# EAGLE design csa_ramdisk-v1.0c (EAGLE 4.16)
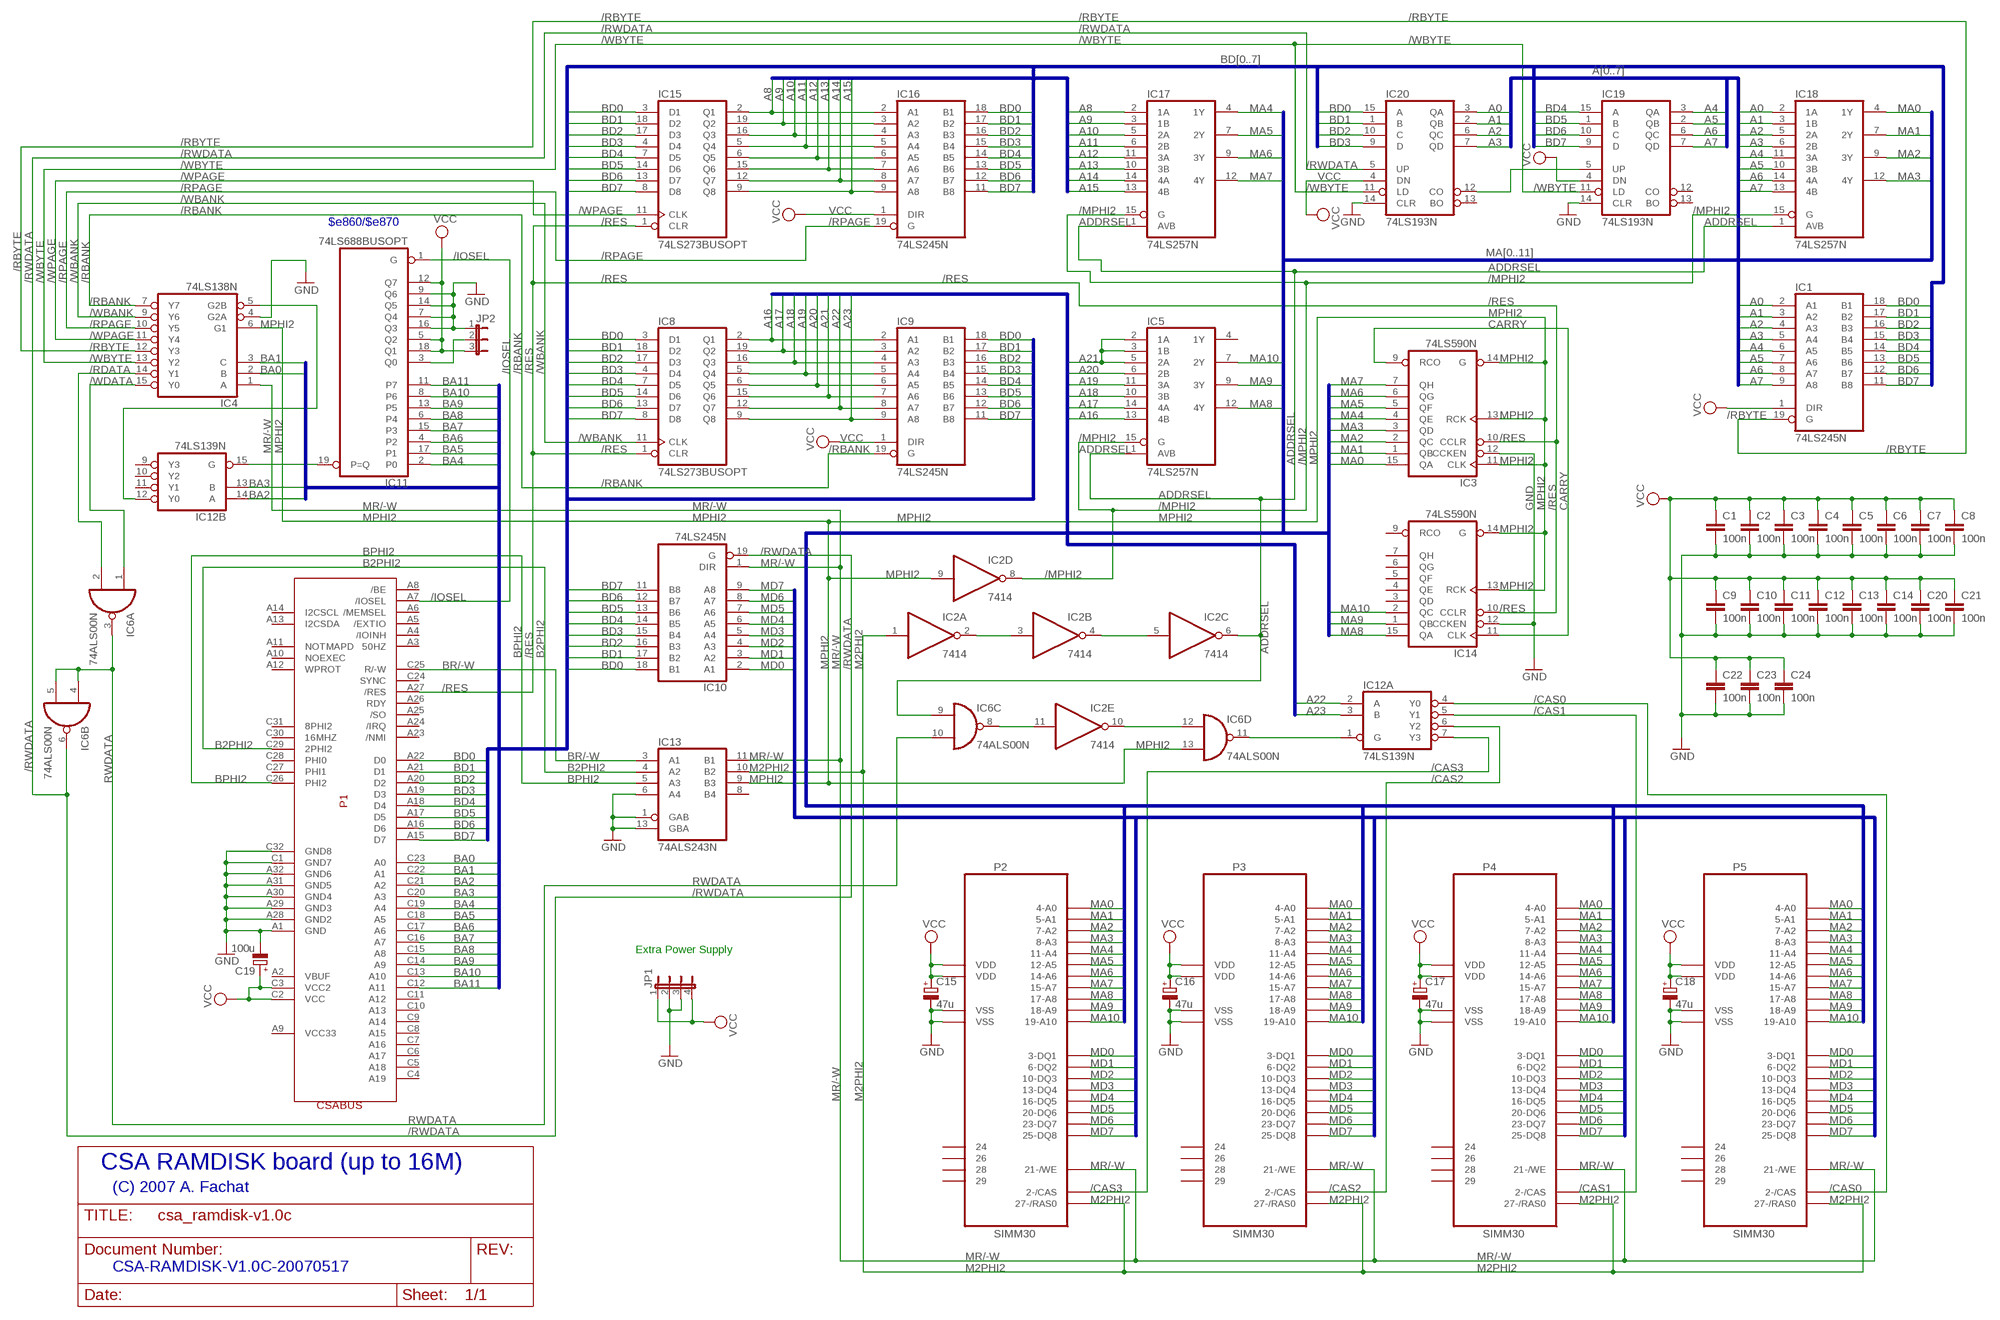
[diagram p0: schematic, sheet 1]

## Parts
C1  100n  C-EU050-025X075  [C050-025X075]
C2  100n  C-EU050-025X075  [C050-025X075]
C3  100n  C-EU050-025X075  [C050-025X075]
C4  100n  C-EU050-025X075  [C050-025X075]
C5  100n  C-EU050-025X075  [C050-025X075]
C6  100n  C-EU050-025X075  [C050-025X075]
C7  100n  C-EU050-025X075  [C050-025X075]
C8  100n  C-EU050-025X075  [C050-025X075]
C9  100n  C-EU050-025X075  [C050-025X075]
C10  100n  C-EU050-025X075  [C050-025X075]
C11  100n  C-EU050-025X075  [C050-025X075]
C12  100n  C-EU050-025X075  [C050-025X075]
C13  100n  C-EU050-025X075  [C050-025X075]
C14  100n  C-EU050-025X075  [C050-025X075]
C15  47u  CPOL-EUE2-5  [E2-5]
C16  47u  CPOL-EUE2-5  [E2-5]
C17  47u  CPOL-EUE2-5  [E2-5]
C18  47u  CPOL-EUE2-5  [E2-5]
C19  100u  CPOL-EUE2-5  [E2-5]
C20  100n  C-EU050-025X075  [C050-025X075]
C21  100n  C-EU050-025X075  [C050-025X075]
C22  100n  C-EU050-025X075  [C050-025X075]
C23  100n  C-EU050-025X075  [C050-025X075]
C24  100n  C-EU050-025X075  [C050-025X075]
IC1  74LS245N  [DIL20]
IC2  7414  74LS04N  [DIL14]
IC3  74LS590N  [DIL16]
IC4  74LS138N  [DIL16]
IC5  74LS257N  [DIL16]
IC6  74ALS00N  [DIL14]
IC8  74LS273BUSOPT  [DIL20]
IC9  74LS245N  [DIL20]
IC10  74LS245N  [DIL20]
IC11  74LS688BUSOPT  [DIL20]
IC12  74LS139N  [DIL16]
IC13  74ALS243N  74LS243N  [DIL14]
IC14  74LS590N  [DIL16]
IC15  74LS273BUSOPT  [DIL20]
IC16  74LS245N  [DIL20]
IC17  74LS257N  [DIL16]
IC18  74LS257N  [DIL16]
IC19  74LS193N  74LS192N  [DIL16]
IC20  74LS193N  74LS192N  [DIL16]
JP1  JP4E  [JP4]
JP2  JP2E  [JP2]
P1  CSABUS  [CSABUS]
P2  SIMM30  [SIMM30]
P3  SIMM30  [SIMM30]
P4  SIMM30  [SIMM30]
P5  SIMM30  [SIMM30]

## Nets
/CAS0: IC12.4(A:Y0) P5.2(2-/CAS)
/CAS1: IC12.5(A:Y1) P4.2(2-/CAS)
/CAS2: IC12.6(A:Y2) P3.2(2-/CAS)
/CAS3: IC12.7(A:Y3) P2.2(2-/CAS)
/IOSEL: IC11.1(G) P1.A7(/IOSEL)
/MPHI2: IC2.8(D:O) IC5.15(G) IC17.15(G) IC18.15(G)
/RBANK: IC4.7(Y7) IC9.19(G)
/RBYTE: IC1.19(G) IC4.12(Y3)
/RDATA: IC4.14(Y1) IC6.2(A:I1)
/RES: IC3.10(CCLR) IC8.1(CLR) IC14.10(CCLR) IC15.1(CLR) P1.A27(/RES)
/RPAGE: IC4.10(Y5) IC16.19(G)
/RWDATA: IC6.6(B:O) IC10.19(G) IC20.5(UP)
/WBANK: IC4.9(Y6) IC8.11(CLK)
/WBYTE: IC4.13(Y2) IC19.11(LD) IC20.11(LD)
/WDATA: IC4.15(Y0) IC6.1(A:I0)
/WPAGE: IC4.11(Y4) IC15.11(CLK)
A0: IC1.2(A1) IC18.2(1A) IC20.3(QA)
A1: IC1.3(A2) IC18.3(1B) IC20.2(QB)
A2: IC1.4(A3) IC18.5(2A) IC20.6(QC)
A3: IC1.5(A4) IC18.6(2B) IC20.7(QD)
A4: IC1.6(A5) IC18.11(3A) IC19.3(QA)
A5: IC1.7(A6) IC18.10(3B) IC19.2(QB)
A6: IC1.8(A7) IC18.14(4A) IC19.6(QC)
A7: IC1.9(A8) IC18.13(4B) IC19.7(QD)
A8: IC15.2(Q1) IC16.2(A1) IC17.2(1A)
A9: IC15.19(Q2) IC16.3(A2) IC17.3(1B)
A10: IC15.16(Q3) IC16.4(A3) IC17.5(2A)
A11: IC15.5(Q4) IC16.5(A4) IC17.6(2B)
A12: IC15.6(Q5) IC16.6(A5) IC17.11(3A)
A13: IC15.15(Q6) IC16.7(A6) IC17.10(3B)
A14: IC15.12(Q7) IC16.8(A7) IC17.14(4A)
A15: IC15.9(Q8) IC16.9(A8) IC17.13(4B)
A16: IC5.13(4B) IC8.2(Q1) IC9.2(A1)
A17: IC5.14(4A) IC8.19(Q2) IC9.3(A2)
A18: IC5.10(3B) IC8.16(Q3) IC9.4(A3)
A19: IC5.11(3A) IC8.5(Q4) IC9.5(A4)
A20: IC5.6(2B) IC8.6(Q5) IC9.6(A5)
A21: IC5.2(1A) IC5.3(1B) IC5.5(2A) IC8.15(Q6) IC9.7(A6)
A22: IC8.12(Q7) IC9.8(A7) IC12.2(A:A)
A23: IC8.9(Q8) IC9.9(A8) IC12.3(A:B)
ADDRSEL: IC2.6(C:O) IC5.1(A\/B) IC6.9(C:I0) IC17.1(A\/B) IC18.1(A\/B)
B2PHI2: IC13.4(A2) P1.C29(2PHI2)
BA0: IC4.2(B) P1.C23(A0)
BA1: IC4.3(C) P1.C22(A1)
BA2: IC12.14(B:A) P1.C21(A2)
BA3: IC12.13(B:B) P1.C20(A3)
BA4: IC11.2(P0) P1.C19(A4)
BA5: IC11.17(P1) P1.C18(A5)
BA6: IC11.4(P2) P1.C17(A6)
BA7: IC11.15(P3) P1.C16(A7)
BA8: IC11.6(P4) P1.C15(A8)
BA9: IC11.13(P5) P1.C14(A9)
BA10: IC11.8(P6) P1.C13(A10)
BA11: IC11.11(P7) P1.C12(A11)
BD0: IC1.18(B1) IC8.3(D1) IC9.18(B1) IC10.18(B1) IC15.3(D1) IC16.18(B1) IC20.15(A) P1.A22(D0)
BD1: IC1.17(B2) IC8.18(D2) IC9.17(B2) IC10.17(B2) IC15.18(D2) IC16.17(B2) IC20.1(B) P1.A21(D1)
BD2: IC1.16(B3) IC8.17(D3) IC9.16(B3) IC10.16(B3) IC15.17(D3) IC16.16(B3) IC20.10(C) P1.A20(D2)
BD3: IC1.15(B4) IC8.4(D4) IC9.15(B4) IC10.15(B4) IC15.4(D4) IC16.15(B4) IC20.9(D) P1.A19(D3)
BD4: IC1.14(B5) IC8.7(D5) IC9.14(B5) IC10.14(B5) IC15.7(D5) IC16.14(B5) IC19.15(A) P1.A18(D4)
BD5: IC1.13(B6) IC8.14(D6) IC9.13(B6) IC10.13(B6) IC15.14(D6) IC16.13(B6) IC19.1(B) P1.A17(D5)
BD6: IC1.12(B7) IC8.13(D7) IC9.12(B7) IC10.12(B7) IC15.13(D7) IC16.12(B7) IC19.10(C) P1.A16(D6)
BD7: IC1.11(B8) IC8.8(D8) IC9.11(B8) IC10.11(B8) IC15.8(D8) IC16.11(B8) IC19.9(D) P1.A15(D7)
BPHI2: IC13.5(A3) P1.C26(PHI2)
BR/-W: IC13.3(A1) P1.C25(R/-W)
CARRY: IC3.9(RCO) IC14.11(CLK)
GND: C1.2 C2.2 C3.2 C4.2 C5.2 C6.2 C7.2 C8.2 C9.2 C10.2 C11.2 C12.2 C13.2 C14.2 C15.- C16.- C17.- C18.- C19.- C20.2 C21.2 C22.2 C23.2 C24.2 IC3.12(CCKEN) IC4.4(G2A) IC11.7(Q4) IC11.9(Q6) IC11.14(Q5) IC11.16(Q3) IC13.1(GAB) IC13.6(A4) IC13.13(GBA) IC14.12(CCKEN) IC19.14(CLR) IC20.14(CLR) JP1.2 JP1.3 JP2.1 P1.A1(GND) P1.A28(GND2) P1.A29(GND3) P1.A30(GND4) P1.A31(GND5) P1.A32(GND6) P1.C1(GND7) P1.C32(GND8) P2.9(VSS) P2.22(VSS) P3.9(VSS) P3.22(VSS) P4.9(VSS) P4.22(VSS) P5.9(VSS) P5.22(VSS)
M2PHI2: IC2.1(A:I) IC13.10(B2) P2.27(27-/RAS0) P3.27(27-/RAS0) P4.27(27-/RAS0) P5.27(27-/RAS0)
MA0: IC3.15(QA) IC18.4(1Y) P2.4(4-A0) P3.4(4-A0) P4.4(4-A0) P5.4(4-A0)
MA1: IC3.1(QB) IC18.7(2Y) P2.5(5-A1) P3.5(5-A1) P4.5(5-A1) P5.5(5-A1)
MA2: IC3.2(QC) IC18.9(3Y) P2.7(7-A2) P3.7(7-A2) P4.7(7-A2) P5.7(7-A2)
MA3: IC3.3(QD) IC18.12(4Y) P2.8(8-A3) P3.8(8-A3) P4.8(8-A3) P5.8(8-A3)
MA4: IC3.4(QE) IC17.4(1Y) P2.11(11-A4) P3.11(11-A4) P4.11(11-A4) P5.11(11-A4)
MA5: IC3.5(QF) IC17.7(2Y) P2.12(12-A5) P3.12(12-A5) P4.12(12-A5) P5.12(12-A5)
MA6: IC3.6(QG) IC17.9(3Y) P2.14(14-A6) P3.14(14-A6) P4.14(14-A6) P5.14(14-A6)
MA7: IC3.7(QH) IC17.12(4Y) P2.15(15-A7) P3.15(15-A7) P4.15(15-A7) P5.15(15-A7)
MA8: IC5.12(4Y) IC14.15(QA) P2.17(17-A8) P3.17(17-A8) P4.17(17-A8) P5.17(17-A8)
MA9: IC5.9(3Y) IC14.1(QB) P2.18(18-A9) P3.18(18-A9) P4.18(18-A9) P5.18(18-A9)
MA10: IC5.7(2Y) IC14.2(QC) P2.19(19-A10) P3.19(19-A10) P4.19(19-A10) P5.19(19-A10)
MD0: IC10.2(A1) P2.3(3-DQ1) P3.3(3-DQ1) P4.3(3-DQ1) P5.3(3-DQ1)
MD1: IC10.3(A2) P2.6(6-DQ2) P3.6(6-DQ2) P4.6(6-DQ2) P5.6(6-DQ2)
MD2: IC10.4(A3) P2.10(10-DQ3) P3.10(10-DQ3) P4.10(10-DQ3) P5.10(10-DQ3)
MD3: IC10.5(A4) P2.13(13-DQ4) P3.13(13-DQ4) P4.13(13-DQ4) P5.13(13-DQ4)
MD4: IC10.6(A5) P2.16(16-DQ5) P3.16(16-DQ5) P4.16(16-DQ5) P5.16(16-DQ5)
MD5: IC10.7(A6) P2.20(20-DQ6) P3.20(20-DQ6) P4.20(20-DQ6) P5.20(20-DQ6)
MD6: IC10.8(A7) P2.23(23-DQ7) P3.23(23-DQ7) P4.23(23-DQ7) P5.23(23-DQ7)
MD7: IC10.9(A8) P2.25(25-DQ8) P3.25(25-DQ8) P4.25(25-DQ8) P5.25(25-DQ8)
MPHI2: IC2.9(D:I) IC3.11(CLK) IC3.13(RCK) IC3.14(G) IC4.6(G1) IC6.13(D:I1) IC13.9(B3) IC14.13(RCK) IC14.14(G)
MR/-W: IC4.1(A) IC10.1(DIR) IC13.11(B1) P2.21(21-/WE) P3.21(21-/WE) P4.21(21-/WE) P5.21(21-/WE)
N$1: IC19.5(UP) IC20.12(CO)
N$2: IC2.11(E:I) IC6.8(C:O)
N$3: IC11.19(P=Q) IC12.15(B:G)
N$4: IC4.5(G2B) IC12.12(B:Y0)
N$5: IC11.3(Q0) JP2.2
N$6: IC6.11(D:O) IC12.1(A:G)
N$7: IC2.10(E:O) IC6.12(D:I0)
N$11: IC2.2(A:O) IC2.3(B:I)
N$12: IC2.4(B:O) IC2.5(C:I)
RWDATA: IC6.3(A:O) IC6.4(B:I0) IC6.5(B:I1) IC6.10(C:I1)
VCC: C1.1 C2.1 C3.1 C4.1 C5.1 C6.1 C7.1 C8.1 C9.1 C10.1 C11.1 C12.1 C13.1 C14.1 C15.+ C16.+ C17.+ C18.+ C19.+ C20.1 C21.1 C22.1 C23.1 C24.1 IC1.1(DIR) IC9.1(DIR) IC11.5(Q2) IC11.12(Q7) IC11.18(Q1) IC16.1(DIR) IC19.4(DN) IC20.4(DN) JP1.1 JP1.4 JP2.3 P1.C2(VCC) P1.C3(VCC2) P2.1(VDD) P2.30(VDD) P3.1(VDD) P3.30(VDD) P4.1(VDD) P4.30(VDD) P5.1(VDD) P5.30(VDD)
Unconnected: IC2.12(F:O) IC2.13(F:I) IC5.4(1Y) IC12.9(B:Y3) IC12.10(B:Y2) IC12.11(B:Y1) IC13.8(B4) IC14.3(QD) IC14.4(QE) IC14.5(QF) IC14.6(QG) IC14.7(QH) IC14.9(RCO) IC19.12(CO) IC19.13(BO) IC20.13(BO) P1.A2(VBUF) P1.A3(50HZ) P1.A4(/IOINH) P1.A5(/EXTIO) P1.A6(/MEMSEL) P1.A8(/BE) P1.A9(VCC33) P1.A10(NOEXEC) P1.A11(NOTMAPD) P1.A12(WPROT) P1.A13(I2CSDA) P1.A14(I2CSCL) P1.A23(/NMI) P1.A24(/IRQ) P1.A25(/SO) P1.A26(RDY) P1.C4(A19) P1.C5(A18) P1.C6(A17) P1.C7(A16) P1.C8(A15) P1.C9(A14) P1.C10(A13) P1.C11(A12) P1.C24(SYNC) P1.C27(PHI1) P1.C28(PHI0) P1.C30(16MHZ) P1.C31(8PHI2) P2.24 P2.26 P2.28 P2.29 P3.24 P3.26 P3.28 P3.29 P4.24 P4.26 P4.28 P4.29 P5.24 P5.26 P5.28 P5.29

## Buses
BA[0..19]
BD[0..7]
A[0..23]
MD[0..7]
MA[0..11]
A[8..15]
A[0..7]

## Notes on the sheet
- $e860/$e870
- Extra Power Supply
- CSA RAMDISK board (up to 16M)
- (C) 2007 A. Fachat
- CSA-RAMDISK-V1.0C-20070517

## Power pins joined to a net without a drawn wire
GND: IC1.10(GND) IC2.7(P:GND) IC3.8(GND) IC4.8(GND) IC5.8(GND) IC6.7(P:GND) IC8.10(GND) IC9.10(GND) IC10.10(GND) IC11.10(GND) IC12.8(P:GND) IC13.7(GND) IC14.8(GND) IC15.10(GND) IC16.10(GND) IC17.8(GND) IC18.8(GND) IC19.8(GND) IC20.8(GND)
VCC: IC1.20(VCC) IC2.14(P:VCC) IC3.16(VCC) IC4.16(VCC) IC5.16(VCC) IC6.14(P:VCC) IC8.20(VCC) IC9.20(VCC) IC10.20(VCC) IC11.20(VCC) IC12.16(P:VCC) IC13.14(VCC) IC14.16(VCC) IC15.20(VCC) IC16.20(VCC) IC17.16(VCC) IC18.16(VCC) IC19.16(VCC) IC20.16(VCC)

## Library data of the parts
C1-C14 C20-C24 = rcl:C-EU: CAPACITOR, European symbol
C15-C19 = rcl:CPOL-EU: POLARIZED CAPACITOR, European symbol
IC1 IC9 IC10 IC16 = 74xx-us:74*245: Octal BUS TRANSCEIVER, 3-state
IC2 = 74xx-us:74*04: Hex INVERTER
IC3 IC14 = 74xx-eu:74*590: 8-bit binary COUNTER, output register
IC4 = 74xx-eu:74*138: 3-line to 8-line DECODER/DEMULTIPLEXER
IC5 IC17 IC18 = 74xx-eu:74*257: Quadruple 2-to 1 line data SELECTOR/MULTIPLEXER
IC6 = 74xx-eu:74*00: Quad 2-input NAND gate
IC8 IC15 = csa:74LS273BUSOPT
IC11 = csa:74LS688BUSOPT
IC12 = 74xx-us:74*139: Dual 2-line to 4-line DECODER/DEMULTIPLEXER
IC13 = 74xx-us:74*243: Quadruple BUS TRANSCEIVER
IC19 IC20 = 74xx-eu:74*192: Synchronous 4-bit UP/DOWN COUNTER
JP1 = jumper:JP4E: JUMPER
JP2 = jumper:JP2E: JUMPER
P1 = csa:CSABUS
P2-P5 = csa:SIMM30

## Board
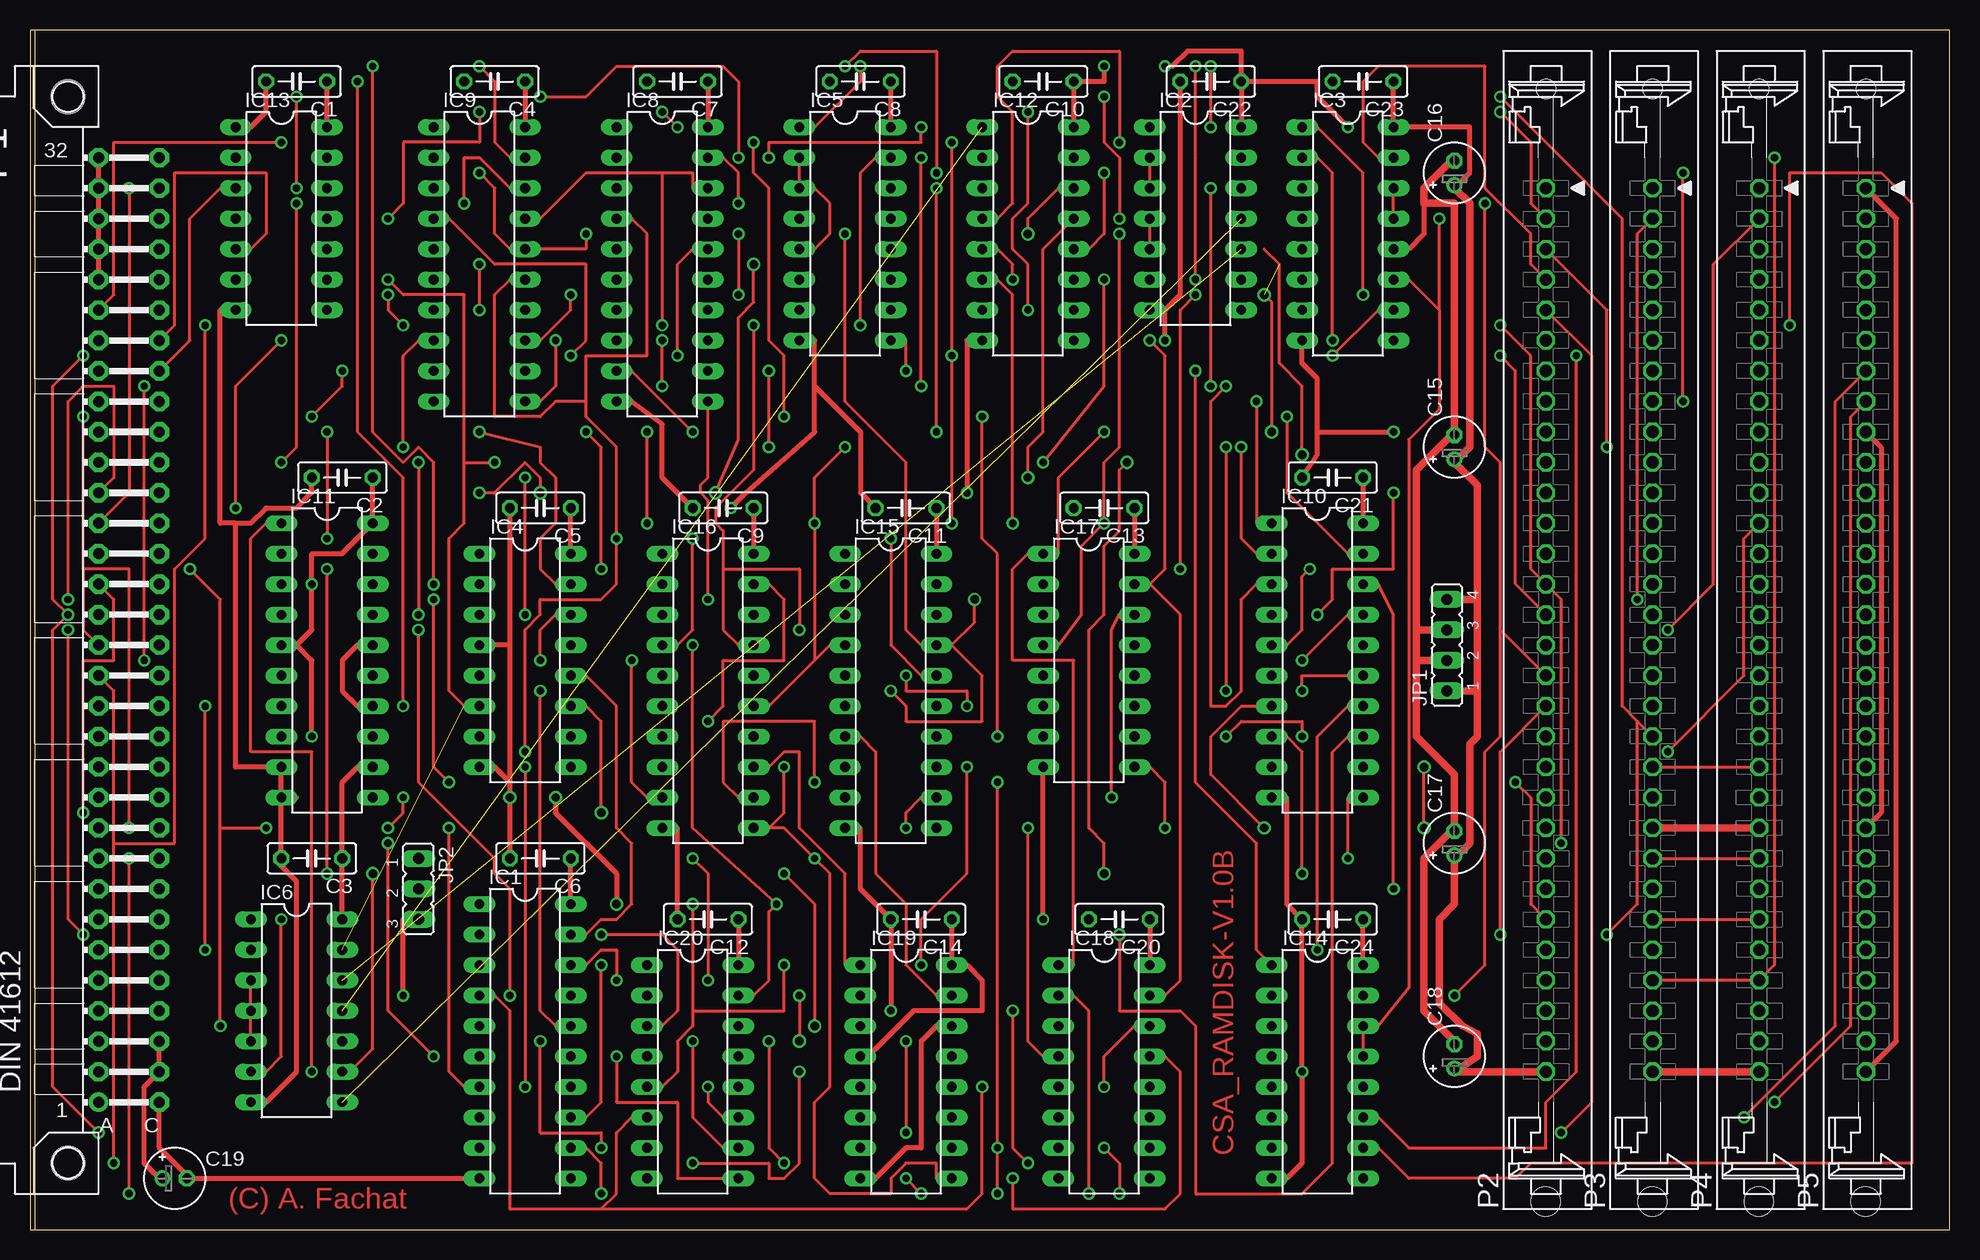
[diagram p1: board, top side]
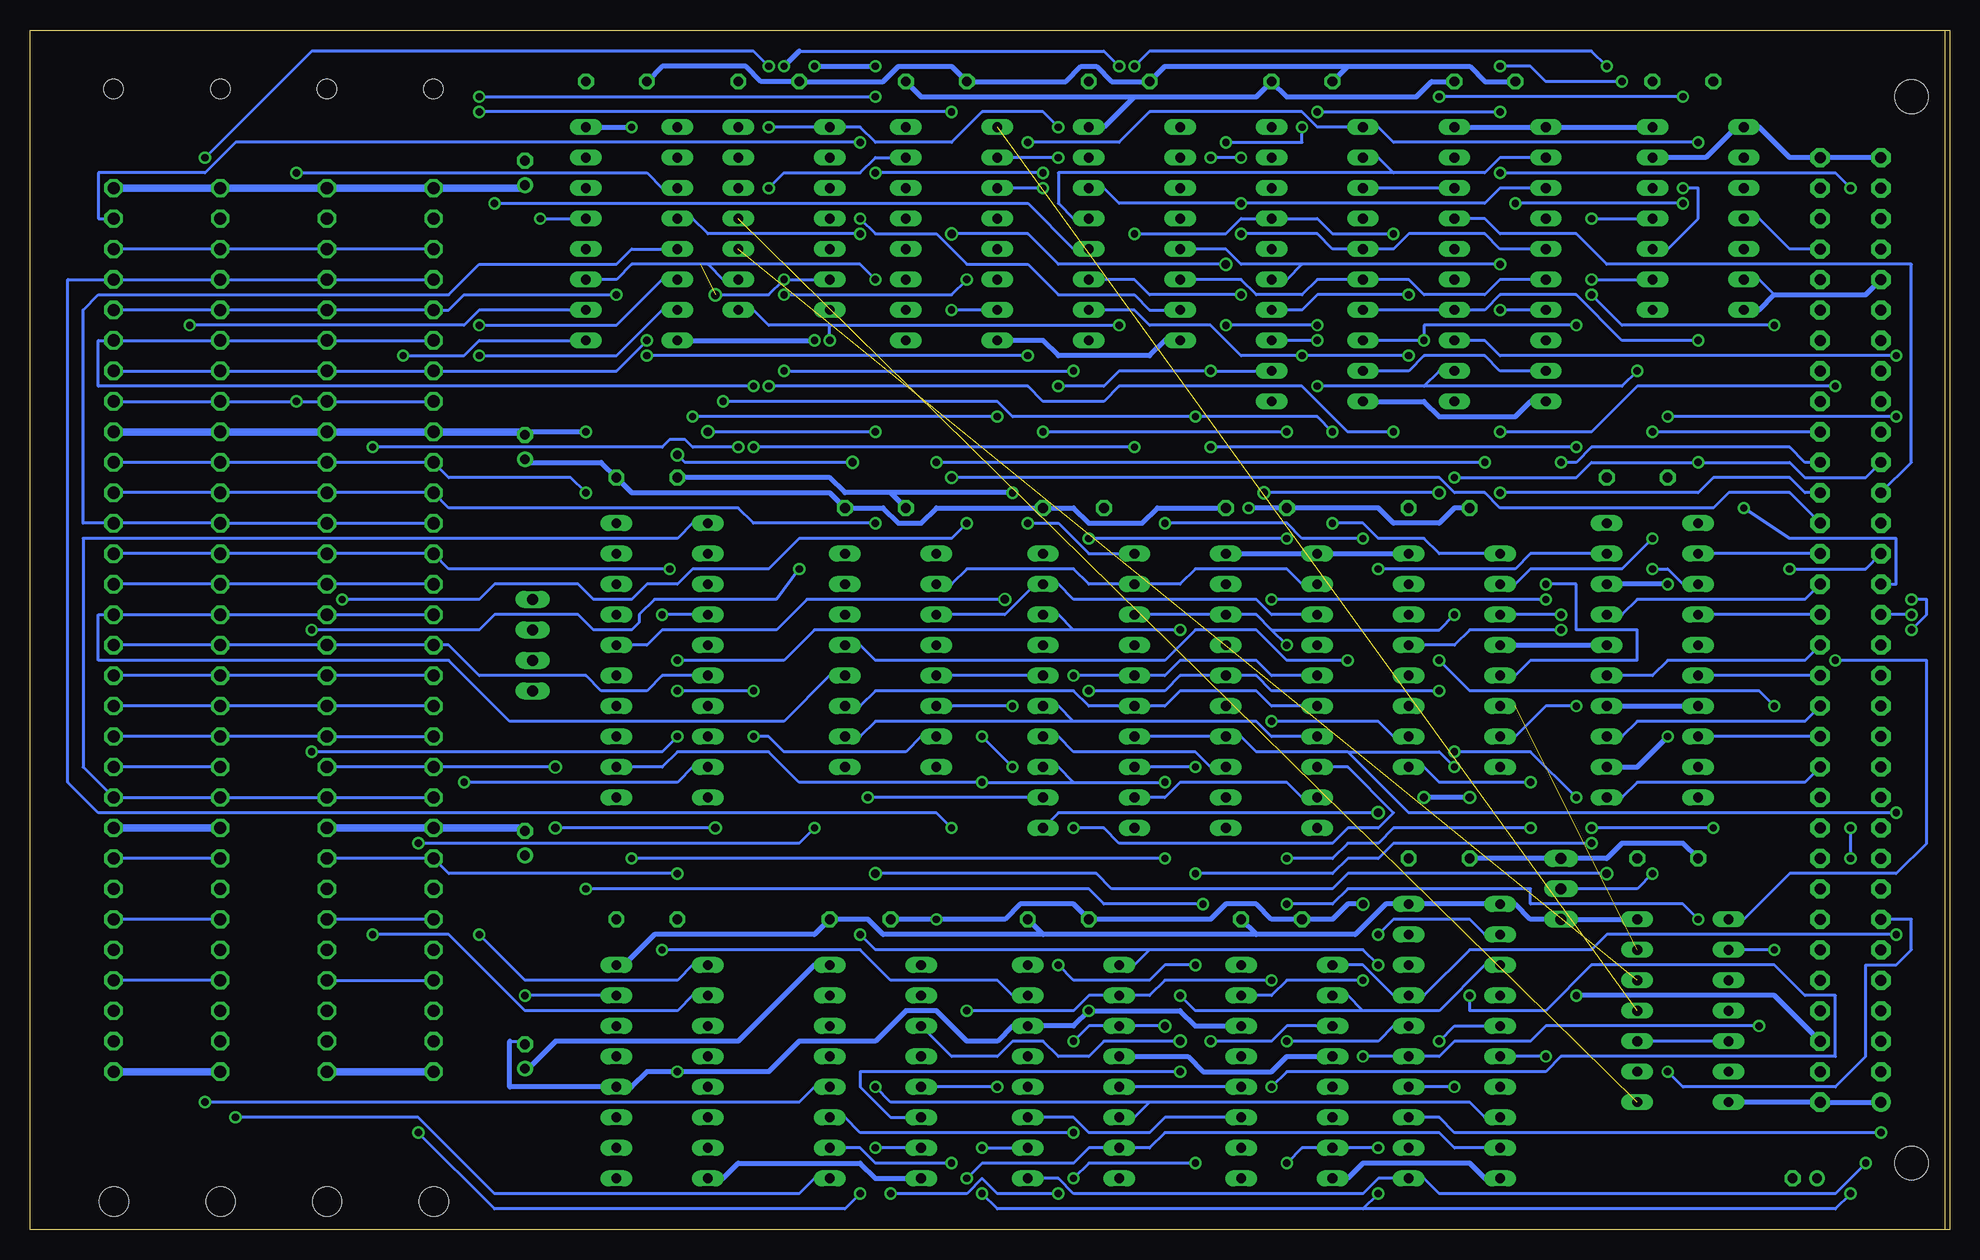
[diagram p2: board, bottom side, seen from below]

Size 160 x 100.03 mm. Coordinates in mm from the lower left corner, seen from the top.
Outline: 0,0.01 160,0.01 160,100.01 0,100.01 0,0.01
Copper layers (1*16): Top 0.035mm / dielectric 1.5mm / Bottom 0.035mm
Design rules "default": minimum track width 10mil, minimum drill 24mil, track to track 8mil, track to pad 8mil, pad to pad 8mil, via to via 8mil, smd to smd 8mil, copper to edge 40mil, drill to drill 8mil, minimum pad ring 10mil, minimum via ring 8mil, stop-mask expansion 4mil, vias tented up to drill 0mil, thermal gap 10mil

### Footprints (pad centres in the part's own frame; a part is rotated, then mirrored left to right if it is on the bottom)
C050-025X075 = drill 0.813 octagon: 1 -2.54,0; 2 2.54,0
E2-5 = drill 0.813 pad 1.27 round: + -1.016,0 | drill 0.813 pad 1.27 octagon: - 1.016,0
DIL20 = drill 0.813 long: 1 -11.43,-3.81; 2 -8.89,-3.81; 3 -6.35,-3.81; 4 -3.81,-3.81; 5 -1.27,-3.81; 6 1.27,-3.81; 7 3.81,-3.81; 8 6.35,-3.81; 9 8.89,-3.81; 10 11.43,-3.81; 11 11.43,3.81; 12 8.89,3.81; 13 6.35,3.81; 14 3.81,3.81; 15 1.27,3.81; 16 -1.27,3.81; 17 -3.81,3.81; 18 -6.35,3.81; 19 -8.89,3.81; 20 -11.43,3.81
DIL14 = drill 0.813 long: 1 -7.62,-3.81; 2 -5.08,-3.81; 3 -2.54,-3.81; 4 0,-3.81; 5 2.54,-3.81; 6 5.08,-3.81; 7 7.62,-3.81; 8 7.62,3.81; 9 5.08,3.81; 10 2.54,3.81; 11 0,3.81; 12 -2.54,3.81; 13 -5.08,3.81; 14 -7.62,3.81
DIL16 = drill 0.813 long: 1 -8.89,-3.81; 2 -6.35,-3.81; 3 -3.81,-3.81; 4 -1.27,-3.81; 5 1.27,-3.81; 6 3.81,-3.81; 7 6.35,-3.81; 8 8.89,-3.81; 9 8.89,3.81; 10 6.35,3.81; 11 3.81,3.81; 12 1.27,3.81; 13 -1.27,3.81; 14 -3.81,3.81; 15 -6.35,3.81; 16 -8.89,3.81
DIL20' = drill 0.813 long: 1 -10.16,-3.81; 2 -7.62,-3.81; 3 -5.08,-3.81; 4 -2.54,-3.81; 5 0,-3.81; 6 2.54,-3.81; 7 5.08,-3.81; 8 7.62,-3.81; 9 10.16,-3.81; 10 12.7,-3.81; 11 12.7,3.81; 12 10.16,3.81; 13 7.62,3.81; 14 5.08,3.81; 15 2.54,3.81; 16 0,3.81; 17 -2.54,3.81; 18 -5.08,3.81; 19 -7.62,3.81; 20 -10.16,3.81
JP4 = drill 0.914 long: 1 -3.81,0; 2 -1.27,0; 3 1.27,0; 4 3.81,0
JP2 = drill 0.914 long: 1 -2.54,0; 2 0,0; 3 2.54,0
CSABUS = drill 0.914 pad 1.6 round: A1 7.62,36.83 | drill 0.914 pad 1.6 octagon: A2 7.62,34.29; A3 7.62,31.75; A4 7.62,29.21; A5 7.62,26.67; A6 7.62,24.13; A7 7.62,21.59; A8 7.62,19.05; A9 7.62,16.51; A10 7.62,13.97; A11 7.62,11.43; A12 7.62,8.89; A13 7.62,6.35; A14 7.62,3.81; A15 7.62,1.27; A16 7.62,-1.27; A17 7.62,-3.81; A18 7.62,-6.35; A19 7.62,-8.89; A20 7.62,-11.43; A21 7.62,-13.97; A22 7.62,-16.51; A23 7.62,-19.05; A24 7.62,-21.59; A25 7.62,-24.13; A26 7.62,-26.67; A27 7.62,-29.21; A28 7.62,-31.75; A29 7.62,-34.29; A30 7.62,-36.83; A31 7.62,-39.37; A32 7.62,-41.91; C1 2.54,36.83; C2 2.54,34.29; C3 2.54,31.75; C4 2.54,29.21; C5 2.54,26.67; C6 2.54,24.13; C7 2.54,21.59; C8 2.54,19.05; C9 2.54,16.51; C10 2.54,13.97; C11 2.54,11.43; C12 2.54,8.89; C13 2.54,6.35; C14 2.54,3.81; C15 2.54,1.27; C16 2.54,-1.27; C17 2.54,-3.81; C18 2.54,-6.35; C19 2.54,-8.89; C20 2.54,-11.43; C21 2.54,-13.97; C22 2.54,-16.51; C23 2.54,-19.05; C24 2.54,-21.59; C25 2.54,-24.13; C26 2.54,-26.67; C27 2.54,-29.21; C28 2.54,-31.75; C29 2.54,-34.29; C30 2.54,-36.83; C31 2.54,-39.37; C32 2.54,-41.91 | hole 2.794: 10.16,41.91; 10.16,-46.99
SIMM30 = drill 1.016 octagon: 1 50.8,1.27; 2 48.26,1.27; 3 45.72,1.27; 4 43.18,1.27; 5 40.64,1.27; 6 38.1,1.27; 7 35.56,1.27; 8 33.02,1.27; 9 30.48,1.27; 10 27.94,1.27; 11 25.4,1.27; 12 22.86,1.27; 13 20.32,1.27; 14 17.78,1.27; 15 15.24,1.27; 16 12.7,1.27; 17 10.16,1.27; 18 7.62,1.27; 19 5.08,1.27; 20 2.54,1.27; 21 0,1.27; 22 -2.54,1.27; 23 -5.08,1.27; 24 -7.62,1.27; 25 -10.16,1.27; 26 -12.7,1.27; 27 -15.24,1.27; 28 -17.78,1.27; 29 -20.32,1.27; 30 -22.86,1.27 | hole 2.413: -33.68,1.295 | hole 1.6: 59.055,1.27

### Placement (x,y rotation side)
C1  22.22,95.73 180 top
C2  26.03,62.71 180 top
C3  23.49,30.96 180 top
C4  38.73,95.73 180 top
C5  42.54,60.17 180 top
C6  42.54,30.96 180 top
C7  53.97,95.73 180 top
C8  69.21,95.73 180 top
C9  57.78,60.17 180 top
C10  84.45,95.73 180 top
C11  73.02,60.17 180 top
C12  56.51,25.88 180 top
C13  89.53,60.17 180 top
C14  74.29,25.88 180 top
C15  118.74,65.25 90 top
C16  118.74,88.11 90 top
C17  118.74,32.23 90 top
C18  118.74,14.45 90 top
C19  12.06,4.29 0 top
C20  90.8,25.88 180 top
C21  108.58,62.71 180 top
C22  98.42,95.73 180 top
C23  111.12,95.73 180 top
C24  108.58,25.88 180 top
IC1  41.27,15.72 270 top
IC2  97.15,84.3 270 top
IC3  109.85,83.03 270 top
IC4  41.27,47.47 270 top
IC5  67.94,83.03 270 top
IC6  22.22,18.26 270 top
IC8  74LS273BUSOPT  [DIL20']  52.7,81.76 270 top
IC9  37.46,80.49 270 top
IC10  107.31,47.47 270 top
IC11  74LS688BUSOPT  [DIL20']  24.76,48.74 270 top
IC12  83.18,83.03 270 top
IC13  20.95,84.3 270 top
IC14  107.31,13.18 270 top
IC15  74LS273BUSOPT  [DIL20']  71.75,46.2 270 top
IC16  56.51,44.93 270 top
IC17  88.26,47.47 270 top
IC18  89.53,13.18 270 top
IC19  73.02,13.18 270 top
IC20  55.24,13.18 270 top
JP1  118.1,48.74 90 top
JP2  32.38,28.42 270 top
P1  13.33,47.47 180 top
P2  127.63,36.04 90 top
P3  136.52,36.04 90 top
P4  145.41,36.04 90 top
P5  154.3,36.04 90 top

### Tracks (layer width: path | path; a pad name or v marks a point on that pad's centre or on a via)
/CAS0  (via drill 0.61)
  Top 0.254: v90.8,90.65 90.8,98.27 81.91,98.27 80.64,97 80.64,94.46 81.91,93.19 81.91,85.57 80.64,84.3 IC12.4
  Bottom 0.254: v90.8,90.65 142.87,90.65 145.41,88.11 154.3,88.11 154.3,84.3 P5.2
/CAS1  (via drill 0.61)
  Top 0.254: v81.91,79.22 81.91,80.49 80.64,81.76 IC12.5 | v97.15,77.95 95.88,76.68 v95.88,55.09 | v136.52,50.01 140.33,53.82 140.33,80.49 P4.2
  Bottom 0.254: v81.91,79.22 83.18,77.95 v97.15,77.95 | v95.88,55.09 97.78,52.55 107.94,52.55 109.21,51.28 109.21,50.65 109.85,50.01 113.02,50.01 114.3,51.28 121.28,51.28 122.55,50.01 v136.52,50.01
/CAS2  (via drill 0.61)
  Top 0.254: v81.91,58.9 81.91,77.95 80.64,79.22 IC12.6 | v133.98,52.55 133.98,83.03 P3.2
  Bottom 0.254: v81.91,58.9 83.18,57.63 95.88,57.63 98.42,55.09 104.77,55.09 106.04,53.82 108.58,53.82 109.85,52.55 113.02,52.55 114.3,53.82 121.28,53.82 122.55,52.55 v133.98,52.55
/CAS3  (via drill 0.61)
  Top 0.254: v83.18,76.68 83.18,80.49 81.91,81.76 81.91,84.3 83.18,85.57 v83.18,93.19 | v122.55,93.19 125.09,90.65 125.09,85.57 P2.2
  Bottom 0.254: v83.18,93.19 v122.55,93.19 | IC12.7 v83.18,76.68
/IOSEL  (via drill 0.61)
  Top 0.254: v23.49,13.18 23.49,39.85 18.41,39.85 18.41,57.63 19.68,58.9 IC11.1
  Bottom 0.254: v23.49,13.18 22.22,11.91 9.52,11.91 6.98,14.45 6.98,22.07 4.44,22.07 3.17,23.34 3.17,25.88 P1.A7
/MPHI2  (via drill 0.61)
  Top 0.254: 93.34,53.82 95.88,51.28 95.88,20.8 94.61,19.53 IC18.15 | v69.21,75.41 69.21,88.11 70.48,89.38 IC5.15 | 93.34,53.82 94.61,55.09 94.61,72.87 v93.34,74.14 | 93.34,53.82 IC17.15
  Bottom 0.254: 93.34,75.41 98.42,75.41 99.69,76.68 IC2.8 | 93.34,75.41 v69.21,75.41 | v93.34,74.14 93.34,75.41
/RBANK  (via drill 0.61)
  Top 0.254: v31.11,43.66 31.11,62.71 27.3,66.52 v27.3,95.73 | v37.46,97 38.73,95.73 38.73,90.65 40,89.38 IC9.19
  Bottom 0.254: v31.11,43.66 33.65,43.66 36.19,41.12 IC4.7 | v27.3,95.73 33.65,95.73 34.92,97 v37.46,97
/RBYTE
  Top 0.254: IC1.19 46.35,24.61 47.62,25.88 48.89,25.88 50.16,27.15 50.16,32.23 48.89,33.5 48.89,43.66 46.35,46.2 IC4.12
/RDATA  (via drill 0.61)
  Top 0.254: v14.6,23.34 v14.6,43.66 | v42.54,47.47 42.54,50.01 43.81,51.28 IC4.14
  Bottom 0.254: v14.6,43.66 15.87,44.93 40,44.93 v42.54,47.47 | v14.6,23.34 IC6.2
/RES  (via drill 0.61)
  Top 0.254: v20.95,90.65 6.98,90.65 6.98,77.95 P1.A27 | v76.83,90.65 v76.83,72.87 v76.83,58.9 | v146.68,75.41 146.68,88.11 154.3,88.11 156.84,85.57 156.84,5.56 125.09,5.56 123.82,4.29 114.93,4.29 112.39,6.83 IC14.10 | v108.58,72.87 112.39,76.68 IC3.10
  Bottom 0.254: v20.95,90.65 46.35,90.65 47.62,91.92 IC8.1 52.7,91.92 53.97,93.19 66.67,93.19 69.21,90.65 v76.83,90.65 | v76.83,58.9 74.29,58.9 71.75,56.36 IC15.1 | v146.68,75.41 123.82,75.41 122.55,76.68 IC3.10 | v76.83,72.87 v108.58,72.87
/RPAGE  (via drill 0.61)
  Top 0.254: v56.51,42.39 57.78,43.66 57.78,47.47 62.86,47.47 62.86,52.55 61.59,53.82 IC16.19
  Bottom 0.254: v56.51,42.39 47.62,42.39 46.35,41.12 IC4.10
/RWDATA  (via drill 0.61)
  Top 0.254: v20.95,25.88 20.95,14.45 19.68,13.18 IC6.6 | 55.24,18.26 55.24,16.99 53.97,15.72 53.97,13.18 52.7,11.91 IC20.5 | v55.24,27.15 55.24,18.26 | v104.77,67.79 104.77,61.44 109.85,56.36 IC10.19 | v79.37,67.79 79.37,57.63 80.64,56.36 v80.64,41.12 | v78.1,38.58 78.1,29.69 74.29,25.88 v74.29,22.07 | v62.86,22.07 62.86,18.26 55.24,18.26
  Bottom 0.254: v20.95,25.88 22.22,27.15 34.92,27.15 34.92,28.42 50.16,28.42 51.43,27.15 v55.24,27.15 | v79.37,67.79 v104.77,67.79 | v78.1,38.58 v80.64,41.12 | v74.29,22.07 73.02,20.8 66.67,20.8 65.4,22.07 v62.86,22.07
/WBANK  (via drill 0.61)
  Top 0.254: v34.92,37.31 33.65,38.58 v33.65,52.55 | v56.51,52.55 56.51,60.81 55.88,61.44 55.88,62.08 56.51,62.71 IC8.11
  Bottom 0.254: v34.92,37.31 42.54,37.31 43.81,38.58 IC4.9 | v33.65,52.55 v56.51,52.55
/WBYTE  (via drill 0.61)
  Top 0.254: v32.38,50.01 32.38,37.31 38.73,30.96 38.73,29.69 40,28.42 v40,19.53 | v56.51,11.91 56.51,10.64 57.78,9.37 IC20.11
  Bottom 0.254: IC20.11 65.4,9.37 66.67,8.1 71.75,8.1 73.02,9.37 IC19.11 | v32.38,50.01 40,50.01 41.27,48.74 IC4.13 | v40,19.53 40,18.26 33.65,18.26 29.84,22.07 14.6,22.07 12.06,19.53 9.52,19.53 9.52,14.45 32.38,14.45 33.65,13.18 55.24,13.18 v56.51,11.91
/WDATA  (via drill 0.61)
  Top 0.254: v9.52,47.47 v9.52,70.33 | v37.46,66.52 42.54,65.25 42.54,63.98 43.81,62.71 43.81,58.9 42.54,57.63 42.54,55.09 43.81,53.82 IC4.15
  Bottom 0.254: v9.52,47.47 1.9,47.47 1.9,32.23 4.44,29.69 13.33,29.69 17.14,25.88 IC6.1 | v9.52,70.33 26.03,70.33 29.84,66.52 v37.46,66.52
/WPAGE  (via drill 0.7)
  Top 0.254: v47.62,34.77 47.62,42.39 46.35,43.66 IC4.11
  Bottom 0.254: IC15.11 74.29,34.77 v47.62,34.77
A0  (via drill 0.61)
  Top 0.254: v47.62,24.61 52.7,24.61 53.97,23.34 53.97,18.26 52.7,16.99 IC20.3 | v88.26,3.02 88.26,18.26 86.99,19.53 IC18.2 | v73.02,4.29 v74.29,3.02 | v62.86,5.56 61.59,6.83 v61.59,15.72
  Bottom 0.254: v47.62,24.61 46.35,25.88 40,25.88 38.73,24.61 IC1.2 | v88.26,3.02 81.91,3.02 80.64,4.29 79.37,3.02 v74.29,3.02 | v73.02,4.29 71.75,5.56 v62.86,5.56 | v61.59,15.72 56.51,15.72 55.24,16.99 IC20.3
A1  (via drill 0.61, 0.7)
  Top 0.254: v64.13,19.53 v64.13,15.72
  Bottom 0.254: 48.89,18.26 50.16,19.53 IC20.2 | 48.89,18.26 42.54,18.26 38.73,22.07 IC1.3 | v64.13,19.53 62.86,18.26 48.89,18.26 | v64.13,15.72 70.48,15.72 71.75,14.45 74.29,14.45 75.56,15.72 78.1,15.72 79.37,14.45 83.18,14.45 IC18.3
A2  (via drill 0.61)
  Top 0.254: 47.62,1.75 48.89,3.02 48.89,8.1 50.16,9.37 IC20.6 | 47.62,1.75 40,1.75 40,18.26 38.73,19.53 IC1.4 | v79.37,11.91 79.37,3.02 78.1,1.75 47.62,1.75
  Bottom 0.254: v79.37,11.91 IC18.5
A3  (via drill 0.61)
  Top 0.254: v47.62,6.83 47.62,8.1 42.54,8.1 v42.54,15.72 | v64.13,13.18 64.13,5.56 62.86,4.29 61.59,4.29 61.59,5.56 v55.24,5.56
  Bottom 0.254: v42.54,15.72 41.27,16.99 IC1.5 | v47.62,6.83 IC20.7 53.97,6.83 v55.24,5.56 | v64.13,13.18 90.8,13.18 90.8,11.91 88.26,9.37 IC18.6
A4  (via drill 0.61, 0.7)
  Top 0.254: v33.65,14.45 29.84,18.26 v29.84,32.23 | v65.4,16.99 65.4,27.15 v62.86,29.69 | v73.02,15.72 v73.02,8.1
  Bottom 0.254: v29.84,32.23 46.35,32.23 47.62,30.96 50.16,30.96 51.43,29.69 v62.86,29.69 | v33.65,14.45 IC1.6 | v73.02,8.1 90.8,8.1 92.07,9.37 IC18.11 | v73.02,15.72 71.75,16.99 IC19.3 v65.4,16.99
A5  (via drill 0.61)
  Top 0.254: v34.92,33.5 34.92,13.18 36.19,11.91 IC1.7 | v55.24,30.96 56.51,29.69 v56.51,20.8 | v83.18,5.56 81.91,6.83 v81.91,18.26
  Bottom 0.254: v34.92,33.5 46.35,33.5 47.62,32.23 50.16,32.23 51.43,30.96 v55.24,30.96 | v56.51,20.8 65.4,20.8 66.67,19.53 IC19.2 71.75,19.53 73.02,18.26 v81.91,18.26 | v83.18,5.56 89.53,5.56 90.8,6.83 IC18.10
A6  (via drill 0.61)
  Top 0.254: v89.53,11.91 89.53,14.45 92.07,16.99 IC18.14
  Bottom 0.254: 66.67,10.64 40,10.64 38.73,9.37 IC1.8 | 66.67,10.64 67.94,9.37 IC19.6 | v89.53,11.91 88.26,10.64 66.67,10.64
A7  (via drill 0.61)
  Top 0.254: v81.91,4.29 81.91,1.75 94.61,1.75 95.88,3.02 95.88,13.18 94.61,14.45 IC18.13
  Bottom 0.254: IC1.9 41.27,6.83 42.54,8.1 65.4,8.1 66.67,6.83 IC19.7 71.75,6.83 73.02,5.56 80.64,5.56 v81.91,4.29
A8
  Bottom 0.254: IC16.2 53.97,53.82 55.24,55.09 62.86,55.09 64.13,53.82 IC15.2 71.75,53.82 73.02,55.09 81.91,55.09 83.18,53.82 IC17.2
A9
  Bottom 0.254: IC16.3 56.51,51.28 57.78,52.55 73.02,52.55 74.29,53.82 IC15.19 76.19,53.82 78.73,51.28 IC17.3
A10  (via drill 0.61)
  Top 0.254: v55.24,57.63 55.24,50.01 53.97,48.74 IC16.4 | v71.75,57.63 71.75,48.74 74.29,46.2 IC15.16
  Bottom 0.254: IC15.16 IC17.5 | v55.24,57.63 v71.75,57.63
A11  (via drill 0.61)
  Top 0.254: v78.1,43.66 78.1,44.93 73.02,44.93 v73.02,46.2
  Bottom 0.254: IC16.5 56.51,46.2 57.78,47.47 64.13,47.47 65.4,46.2 IC15.5 v73.02,46.2 | v78.1,43.66 IC17.6
A12
  Bottom 0.254: IC16.6 56.51,43.66 57.78,44.93 64.13,44.93 65.4,43.66 IC15.6 71.75,43.66 73.02,44.93 89.53,44.93 90.8,43.66 IC17.11
A13
  Bottom 0.254: 73.02,42.39 57.78,42.39 56.51,41.12 IC16.7 | 73.02,42.39 74.29,43.66 IC15.15 | 73.02,42.39 89.53,42.39 90.8,41.12 IC17.10
A14  (via drill 0.61)
  Top 0.254: v73.02,33.5 73.02,34.77 74.29,36.04 IC15.12 | v90.16,36.04 90.16,50.01 90.8,51.28 IC17.14
  Bottom 0.254: v73.02,33.5 70.48,33.5 69.21,32.23 51.43,32.23 50.16,33.5 47.62,33.5 46.35,34.77 50.16,38.58 IC16.8 | IC15.12 v90.16,36.04
A15  (via drill 0.61)
  Top 0.254: v50.16,47.47 50.16,37.31 51.43,36.04 IC16.9
  Bottom 0.254: IC16.9 53.97,36.04 55.24,37.31 64.13,37.31 65.4,36.04 IC15.9 | v50.16,47.47 55.24,47.47 57.78,50.01 62.86,50.01 65.4,47.47 89.53,47.47 90.8,48.74 IC17.13
A16
  Bottom 0.254: 46.35,88.11 38.73,88.11 37.46,89.38 IC9.2 | 46.35,88.11 47.62,89.38 IC8.2 | 46.35,88.11 74.29,88.11 74.29,85.57 73.02,84.3 IC5.13
A17  (via drill 0.61)
  Top 0.254: v59.05,85.57 59.05,88.11 57.78,89.38 IC8.19
  Bottom 0.254: IC9.3 37.46,86.84 38.73,85.57 v59.05,85.57 69.21,85.57 70.48,86.84 IC5.14
A18  (via drill 0.61)
  Top 0.254: v53.97,72.87 53.97,80.49 55.24,81.76 IC8.16 | v45.08,72.87 46.35,74.14 46.35,80.49 38.73,80.49 34.92,84.3 IC9.4
  Bottom 0.254: IC5.10 67.94,76.68 66.67,75.41 61.59,75.41 59.05,72.87 v53.97,72.87 v45.08,72.87
A19  (via drill 0.61)
  Top 0.254: v59.05,83.03 v59.05,77.95
  Bottom 0.254: IC9.5 37.46,81.76 38.73,83.03 45.08,83.03 46.35,81.76 IC8.5 51.43,81.76 52.7,83.03 v59.05,83.03 | v59.05,77.95 66.67,77.95 67.94,79.22 IC5.11
A20
  Bottom 0.254: IC9.6 37.46,79.22 38.73,77.95 43.81,77.95 45.08,79.22 IC8.6 52.7,79.22 53.97,77.95 57.78,77.95 59.05,79.22 IC5.6
A21  (via drill 0.61)
  Top 0.254: IC5.2 IC5.3 65.4,86.84 66.67,85.57 66.67,83.03 65.4,81.76 IC5.5 | v37.46,76.68 v37.46,80.49
  Bottom 0.254: v37.46,80.49 53.97,80.49 | 53.97,80.49 55.24,79.22 IC8.15 | IC9.7 v37.46,76.68 | 53.97,80.49 59.05,80.49 60.32,81.76 IC5.5
A22  (via drill 0.61)
  Top 0.254: v31.11,65.25 31.11,72.87 32.38,74.14 IC9.8 | v61.59,65.25 v61.59,71.6 | v74.29,70.33 v74.29,89.38
  Bottom 0.254: v31.11,65.25 v61.59,65.25 | IC8.12 v61.59,71.6 69.21,71.6 70.48,70.33 v74.29,70.33 | v74.29,89.38 IC12.2
A23  (via drill 0.61)
  Top 0.254: v75.56,66.52 v75.56,86.84 | v55.24,66.52 50.16,71.6 IC8.9
  Bottom 0.254: IC9.9 37.46,71.6 38.73,72.87 43.81,72.87 45.08,71.6 IC8.9 | v55.24,66.52 v75.56,66.52 | v75.56,86.84 IC12.3
ADDRSEL  (via drill 0.61, 0.7)  (1 unrouted)
  Top 0.254: IC18.1 86.99,22.07 86.99,47.47 81.91,47.47 81.91,55.09 83.18,56.36 IC17.1 85.72,56.36 85.72,62.71 v89.53,66.52 | v69.21,97 69.21,95.73 65.4,91.92 IC5.1 | v97.15,79.22 97.15,89.38 v97.15,97 | v103.5,66.52 103.5,77.32 v102.86,77.95 | IC6.9 26.66,13.18 28.57,15.09 v28.57,29.69 | v89.53,29.69 89.53,32.23 88.26,33.5 88.26,50.01 89.53,51.28 89.53,57 90.8,58.27 90.8,63.35 v91.44,63.98 | v106.04,64.62 106.04,70.33 104.13,72.24 104.13,80.49 102.86,81.76
  Bottom 0.254: IC2.6 v97.15,79.22 98.42,77.95 v102.86,77.95 | v69.21,97 70.48,98.27 95.88,98.27 | v89.53,66.52 v103.5,66.52 | v28.57,29.69 50.16,29.69 51.43,28.42 69.84,28.42 71.11,29.69 v89.53,29.69 | v91.44,63.98 105.41,63.98 v106.04,64.62
  Bottom 0.406: v97.15,97 95.88,98.27
B2PHI2
  Bottom 0.254: P1.C29 13.33,81.76 15.87,84.3 IC13.4
BA0  (via drill 0.61)
  Top 0.254: v24.76,66.52 v24.76,57.63
  Bottom 0.254: v24.76,57.63 27.3,55.09 34.92,55.09 36.19,53.82 IC4.2 | P1.C23 v24.76,66.52
BA1  (via drill 0.61)
  Top 0.254: v32.38,63.98 v32.38,51.28
  Bottom 0.254: P1.C22 12.06,63.98 13.33,65.25 29.84,65.25 31.11,63.98 v32.38,63.98 | v32.38,51.28 IC4.3
BA2  (via drill 0.61, 0.7)
  Top 0.254: IC12.14 85.72,86.84 83.18,84.3 v83.18,83.03 | v60.32,80.49 60.32,77.32 59.05,76.05 59.05,65.89 v57.15,61.44 | v42.54,61.44 42.54,62.71 41.27,63.98 38.73,61.44 v37.46,61.44
  Bottom 0.254: v83.18,83.03 76.83,83.03 74.29,80.49 v60.32,80.49 | P1.C21 12.06,61.44 13.33,62.71 19.68,62.71 20.95,61.44 v37.46,61.44 | v42.54,61.44 v57.15,61.44
BA3  (via drill 0.7)
  Top 0.254: IC12.13 84.45,81.76 84.45,66.52 83.18,65.25 v83.18,62.71
  Bottom 0.254: v83.18,62.71 42.54,62.71 41.27,61.44 38.73,61.44 37.46,60.17 19.68,60.17 18.41,61.44 13.33,61.44 P1.C20
BA4
  Bottom 0.254: P1.C19 IC11.2
BA5
  Bottom 0.254: P1.C18 12.06,52.55 26.03,52.55 27.3,51.28 IC11.17
BA6
  Bottom 0.254: P1.C17 IC11.4
BA7
  Bottom 0.254: P1.C16 12.06,47.47 23.49,47.47 24.76,46.2 IC11.15
BA8
  Bottom 0.254: P1.C15 IC11.6
BA9
  Bottom 0.254: P1.C14 12.06,42.39 26.03,42.39 27.3,41.12 IC11.13
BA10
  Bottom 0.254: P1.C13 IC11.8
BA11
  Bottom 0.254: P1.C12 12.06,37.31 26.03,37.31 27.3,36.04 IC11.11
BD0  (via drill 0.61)
  Top 0.254: v55.24,48.74 55.24,33.5 v62.23,27.15 61.59,26.52 61.59,20.8 60.32,19.53 IC20.15 | v48.89,20.8 48.89,23.34 47.62,23.34 46.35,22.07 IC1.18 | v113.66,28.42 113.66,51.28 112.39,53.82 IC10.18 | v41.27,51.28 v41.27,62.71 | v36.19,85.57 36.19,89.38 37.46,89.38 40,86.84 IC9.18 | v20.95,63.98 22.22,65.25 v22.22,85.57
  Bottom 0.254: IC9.18 IC8.3 | 56.51,50.01 57.78,51.28 IC16.18 IC15.3 | v55.24,48.74 56.51,50.01 | v48.89,20.8 55.24,20.8 56.51,19.53 IC20.15 | v113.66,28.42 71.75,28.42 70.48,27.15 v62.23,27.15 | P1.A22 6.98,62.71 12.06,62.71 13.33,63.98 v20.95,63.98 29.84,63.98 31.11,62.71 v41.27,62.71 | v41.27,51.28 42.54,50.01 56.51,50.01 | v22.22,85.57 v36.19,85.57
BD1  (via drill 0.61)
  Top 0.254: 57.78,55.09 57.78,50.01 59.05,48.74 IC16.17 | 57.78,55.09 64.13,55.09 v64.13,50.01 | v106.04,47.47 109.85,51.28 IC10.17 | 52.7,88.11 55.24,88.11 55.24,86.84 IC8.18 | 52.7,88.11 46.35,88.11 42.54,84.3 IC9.17 | v4.44,24.61 3.17,25.88 v3.17,50.01 | v3.17,52.55 3.17,69.06 4.44,70.33 6.98,70.33 6.98,62.71 P1.A21 | 57.78,55.09 57.78,58.27 57.15,58.9 57.15,60.17 60.32,63.35 v60.32,75.41 | 52.7,88.11 v52.7,75.41
  Bottom 0.254: v64.13,50.01 73.02,50.01 | 73.02,50.01 74.29,51.28 IC15.18 | v106.04,47.47 97.15,47.47 94.61,50.01 73.02,50.01 | IC20.1 48.89,22.07 46.35,19.53 IC1.17 43.81,19.53 40,23.34 29.84,23.34 28.57,24.61 v4.44,24.61 | P1.A21 3.17,63.98 3.17,80.49 28.57,80.49 31.11,83.03 37.46,83.03 38.73,84.3 IC9.17 | v3.17,50.01 1.9,51.28 1.9,52.55 v3.17,52.55 | v52.7,75.41 v60.32,75.41
BD2  (via drill 0.61, 0.7)
  Top 0.254: v55.24,15.72 55.24,9.37 57.78,6.83 IC20.10 | v42.54,44.93 42.54,18.26 43.81,16.99 IC1.16 | v67.94,83.03 67.94,69.06 73.02,63.98 73.02,50.01 74.29,48.74 IC15.17 76.83,48.74 | 76.83,48.74 79.37,46.2 79.37,42.39 73.02,42.39 73.02,43.66 v71.75,44.93 | v46.35,83.03 46.35,81.76 IC9.16 40,81.76 38.73,83.03 38.73,86.84 v37.46,88.11 | P1.A20 8.25,61.44 v8.25,86.84 | v78.73,52.55 78.73,50.65 76.83,48.74
  Bottom 0.254: v55.24,15.72 47.62,15.72 46.35,16.99 IC1.16 | v42.54,44.93 56.51,44.93 57.78,46.2 IC16.16 64.13,46.2 65.4,44.93 v71.75,44.93 | v67.94,83.03 60.32,83.03 59.05,84.3 IC8.17 52.7,84.3 51.43,83.03 v46.35,83.03 | v8.25,86.84 9.52,88.11 v37.46,88.11 | IC10.16 108.58,48.74 107.31,50.01 97.78,50.01 95.24,52.55 v78.73,52.55
BD3  (via drill 0.61)
  Top 0.254: v48.89,14.45 48.89,10.64 53.97,10.64 53.97,4.29 IC20.9 | v13.33,55.09 15.87,52.55 15.87,33.5 | v15.87,16.99 15.87,33.5 | 46.35,69.06 43.81,69.06 42.54,67.79 38.73,67.79 38.73,77.95 40,79.22 IC9.15 | 46.35,69.06 46.35,72.87 51.43,72.87 51.43,83.03 50.16,84.3 IC8.4 | 65.4,47.47 66.67,48.74 IC15.4 | 65.4,47.47 61.59,43.66 IC16.15 | v106.04,44.93 106.04,46.2 IC10.15 | v99.69,65.25 v99.69,44.93 | v67.94,65.25 65.4,62.71 v65.4,58.9 65.4,47.47 | 46.35,69.06 46.35,67.79 48.89,65.25 v48.89,57.63 48.89,53.82 47.62,52.55 42.54,52.55 42.54,51.28 41.27,50.01 v41.27,39.85 | 15.87,33.5 v19.68,33.5 | v29.84,33.5 31.11,34.77 v31.11,36.04
  Bottom 0.254: v48.89,14.45 IC1.15 42.54,14.45 41.27,15.72 34.92,15.72 33.65,16.99 v15.87,16.99 | P1.A19 6.98,55.09 v13.33,55.09 | v99.69,44.93 v106.04,44.93 | v67.94,65.25 v99.69,65.25 | v48.89,57.63 53.97,57.63 55.24,58.9 v65.4,58.9 | v19.68,33.5 v29.84,33.5 | v31.11,36.04 34.92,39.85 v41.27,39.85
BD4  (via drill 0.61)
  Top 0.254: v41.27,38.58 v41.27,11.91 | IC19.15 75.56,19.53 73.02,22.07 73.02,27.15 70.48,29.69 70.48,39.85 69.21,41.12 IC15.7 | v107.31,23.34 107.31,41.12 109.85,43.66 IC10.14 | P1.A18 6.98,52.55 6.98,47.47 4.44,47.47 v4.44,34.77 | v20.95,74.14 17.14,70.33 v17.14,60.17
  Bottom 0.254: IC8.7 IC9.14 38.73,76.68 37.46,77.95 31.11,77.95 27.3,74.14 v20.95,74.14 | v41.27,38.58 42.54,39.85 50.16,39.85 | 50.16,39.85 57.78,39.85 59.05,41.12 IC16.14 IC15.7 | v41.27,11.91 IC1.14 | v107.31,23.34 90.8,23.34 88.26,20.8 79.37,20.8 78.1,19.53 IC19.15 | v4.44,34.77 45.08,34.77 50.16,39.85 | v17.14,60.17 13.33,57.63 4.44,57.63 4.44,53.82 P1.A18
BD5  (via drill 0.61)
  Top 0.254: v45.08,77.95 45.08,76.68 42.54,74.14 IC9.13 | v4.44,72.87 1.9,70.33 1.9,52.55 v3.17,51.28 1.9,50.01 1.9,11.91 v5.71,8.1 | v47.62,22.07 47.62,10.64 46.35,9.37 IC1.13 | v90.8,24.61 90.8,18.26 95.88,18.26 97.15,16.99 97.15,3.02 106.04,3.02 108.58,5.56 108.58,39.85 109.85,41.12 IC10.13 | IC16.13 61.59,38.58 62.86,39.85 64.13,39.85 64.13,33.5 67.94,29.69 67.94,22.07 IC19.1
  Bottom 0.254: v45.08,77.95 52.7,77.95 53.97,76.68 IC8.14 | v3.17,51.28 P1.A17 | v4.44,72.87 37.46,72.87 38.73,74.14 IC9.13 | IC16.13 61.59,38.58 62.86,39.85 73.02,39.85 74.29,41.12 IC15.14 | v47.62,22.07 48.89,23.34 66.67,23.34 | 66.67,23.34 67.94,22.07 IC19.1 | v90.8,24.61 89.53,23.34 66.67,23.34 | v5.71,8.1 41.27,8.1 42.54,9.37 IC1.13
BD6  (via drill 0.61)
  Top 0.254: v52.7,70.33 v52.7,74.14 | P1.A16 4.44,50.01 4.44,55.09 | 4.44,55.09 v4.44,67.79 | v23.49,67.79 26.03,70.33 v26.03,71.6 | v47.62,3.02 47.62,5.56 46.35,6.83 IC1.12 | v80.64,3.02 v80.64,6.83 v80.64,37.31 | v65.4,37.31 65.4,42.39 57.78,42.39 57.78,37.31 59.05,36.04 IC16.12 | 4.44,55.09 8.25,55.09 v8.25,33.5 | v8.25,3.02 v8.25,30.96
  Bottom 0.254: 43.81,70.33 42.54,71.6 IC9.12 | 43.81,70.33 v52.7,70.33 | v52.7,74.14 IC8.13 | v4.44,67.79 v23.49,67.79 | v26.03,71.6 27.3,70.33 43.81,70.33 | 48.89,1.75 v47.62,3.02 | 48.89,1.75 79.37,1.75 v80.64,3.02 | v80.64,6.83 IC19.10 | 73.02,37.31 v65.4,37.31 | 73.02,37.31 74.29,38.58 IC15.13 | 73.02,37.31 v80.64,37.31 95.88,37.31 98.42,39.85 106.04,39.85 107.31,38.58 IC10.12 | v8.25,30.96 v8.25,33.5 | v8.25,3.02 9.52,1.75 48.89,1.75
BD7  (via drill 0.61)
  Top 0.254: 61.59,33.5 62.86,34.77 v62.86,38.58 | v109.85,30.96 109.85,36.04 IC10.11 | 61.59,33.5 62.86,33.5 v65.4,30.96 66.67,29.69 66.67,11.91 65.4,10.64 65.4,4.29 66.67,3.02 71.75,3.02 71.75,4.29 73.02,5.56 75.56,5.56 75.56,4.29 IC19.9 | 61.59,33.5 IC16.11 | v43.81,74.14 43.81,70.33 42.54,69.06 IC9.11 | P1.A15 6.98,44.93 6.98,32.23 | v6.98,5.56 6.98,32.23 | v31.11,75.41 29.84,76.68 v29.84,77.95 | v14.6,75.41 14.6,57.63 12.06,55.09 12.06,32.23 6.98,32.23
  Bottom 0.254: v62.86,38.58 IC15.8 | v65.4,30.96 v109.85,30.96 | IC8.8 v43.81,74.14 43.81,75.41 v31.11,75.41 | IC19.9 74.29,4.29 73.02,3.02 48.89,3.02 47.62,4.29 IC1.11 43.81,4.29 42.54,3.02 9.52,3.02 v6.98,5.56 | v29.84,77.95 27.3,75.41 v14.6,75.41
BPHI2
  Top 0.254: P1.C26 12.06,75.41 12.06,88.11 19.68,88.11 19.68,83.03 18.41,81.76 IC13.5
BR/-W
  Top 0.254: P1.C25 13.33,74.14 13.33,84.3 15.87,86.84 IC13.3
CARRY  (via drill 0.61)
  Top 0.254: v128.9,72.87 128.9,13.18 126.36,10.64 126.36,6.83 114.93,6.83 112.39,9.37 IC14.11
  Bottom 0.254: v128.9,72.87 123.82,72.87 122.55,74.14 IC3.9
GND  (via drill 0.61, 0.7)
  Top 0.254: 27.3,43.66 IC11.14 | C19.- 13.33,4.29 | IC6.7 19.68,10.64 | 118.74,89.38 C16.-
  Top 0.406: C9.2 52.7,62.71 52.7,67.16 50.16,69.06 IC8.10 | 27.3,43.66 26.03,44.93 26.03,47.47 27.3,48.74 IC11.16 | 40,37.31 38.73,38.58 IC4.8 | C6.2 v40,36.04 40,37.31 | 40,37.31 40,48.74 | 40,48.74 C5.2 | 40,48.74 IC4.4 | P1.C1 10.79,6.83 13.33,4.29 IC1.10 | C1.2 19.68,93.19 18.41,91.92 IC13.1 | P1.A28 P1.A29 P1.A30 P1.A31 P1.A32 | IC11.10 C3.2 20.95,30.33 22.22,29.06 22.22,13.18 19.68,10.64 | IC11.10 IC11.9 17.14,38.58 17.14,58.9 | C2.2 23.49,61.44 22.22,60.17 19.68,60.17 18.41,58.9 17.14,58.9 | 17.14,58.9 15.87,58.9 15.87,76.68 IC13.7 | IC11.10 22.22,36.04 | C11.2 69.21,61.44 69.21,66.52 65.4,70.33 | 65.4,70.33 65.4,74.14 IC5.8 | C21.2 107.31,64.62 107.31,66.52 | 107.31,66.52 107.31,70.97 106.04,72.24 IC3.8 | v78.1,61.44 78.1,74.14 IC12.8 | 94.61,76.68 95.88,77.95 C22.2 | v94.61,74.14 94.61,76.68 | 94.61,76.68 IC2.7 | 116.2,85.57 116.2,83.03 114.93,81.76 IC3.12 | C15.- 118.74,66.52 | P5.22 154.3,34.77 154.3,65.25 P5.9 | IC10.10 104.77,36.04 104.77,27.15 C24.2 v106.04,13.18 106.04,5.56 104.77,4.29 IC14.8 | C12.2 53.97,33.5 IC16.10 | IC15.10 69.21,33.5 69.21,28.42 C14.2 v71.75,18.26 | v84.45,25.88 IC17.8 | IC19.8 70.48,4.29 73.02,6.83 74.29,6.83 74.29,15.72 75.56,16.99 IC19.14 | 107.31,66.52 v113.66,66.52 | v58.41,60.17 59.69,61.44 65.4,66.52 65.4,70.33 | v48.89,27.15 48.89,29.69 43.81,34.77 v43.81,36.04
  Top 0.61: P4.22 P3.22 | 118.74,89.38 116.2,86.84 116.2,85.57 118.74,85.57 118.74,66.52 115.56,63.35 115.56,50.01 | 115.56,50.01 115.56,47.47 | 115.56,47.47 115.56,41.12 118.74,37.95 118.74,33.5 116.2,30.96 116.2,18.26 118.74,15.72 | 115.56,50.01 JP1.3 | 115.56,47.47 JP1.2
  Bottom 0.254: 118.74,33.5 C17.- | 120.01,15.72 118.74,15.72 | 118.74,66.52 C15.- | 14.6,77.95 15.87,79.22 IC13.6
  Bottom 0.305: 15.87,91.92 IC13.1
  Bottom 0.406: IC9.10 34.92,69.06 36.19,67.79 42.54,67.79 43.81,69.06 IC8.10 | IC11.14 IC11.7 | IC4.4 IC11.16 | C6.2 JP2.1 28.57,30.96 27.3,32.23 22.22,32.23 C3.2 | C5.2 41.27,60.17 42.54,58.9 46.35,58.9 47.62,60.17 C9.2 v58.41,60.17 | IC20.8 50.16,4.29 48.89,5.56 40,5.56 38.73,4.29 IC1.10 | IC6.7 P1.C1 P1.A1 | IC13.13 20.31,89.38 17.77,91.92 IC13.1 | P1.A32 P1.C32 13.33,89.38 15.87,91.92 | P1.A28 6.98,77.95 14.6,77.95 15.87,76.68 IC13.7 | IC12.8 75.56,74.14 74.29,72.87 66.67,72.87 65.4,74.14 IC5.8 | 88.26,61.44 C13.2 | 88.26,61.44 92.07,61.44 93.34,62.71 C21.2 | v78.1,61.44 88.26,61.44 | C4.2 38.73,95.73 40,97 50.16,97 | 50.16,97 C7.2 | 50.16,97 65.4,97 C8.2 69.84,95.73 71.11,97 72.38,97 73.66,95.73 C10.2 83.18,97 87.62,97 88.89,95.73 C22.2 99.05,95.73 100.32,97 107.31,97 C23.2 | IC3.8 v94.61,74.14 | IC18.8 89.53,4.29 90.8,5.56 100.96,5.56 102.23,4.29 IC14.8 | C20.2 v84.45,25.88 78.73,25.88 77.46,27.15 73.02,27.15 C14.2 61.59,25.88 60.32,27.15 57.78,27.15 56.51,25.88 C12.2 51.43,25.88 50.16,27.15 v48.89,27.15 | 120.01,15.72 120.01,11.91 IC14.12 109.85,11.91 108.58,13.18 v106.04,13.18 98.42,13.18 95.88,15.72 89.53,15.72 86.99,18.26 84.45,18.26 81.91,15.72 79.37,15.72 78.1,16.99 IC19.14 73.02,16.99 v71.75,18.26 64.13,18.26 62.86,16.99 IC20.14 | 118.74,15.72 C18.- | v113.66,66.52 118.74,66.52 | v40,36.04 v43.81,36.04
  Bottom 0.61: 118.74,33.5 P2.22 P3.22 | P5.22 P4.22 | 118.74,66.52 P2.9 P3.9 P4.9 P5.9
M2PHI2  (via drill 0.61)
  Top 0.254: P3.27 P4.27 145.41,22.07 v145.41,89.38 | v22.22,86.84 v22.22,94.46 | v42.54,94.46 46.35,94.46 48.89,97 57.78,97 59.05,95.73 v59.05,89.38 | v61.59,89.38 61.59,90.65 74.29,90.65 v74.29,91.92 | v98.42,91.92 v98.42,97
  Bottom 0.254: P3.27 P2.27 | P4.27 P5.27 | v22.22,86.84 20.95,86.84 20.95,84.3 23.49,81.76 IC13.10 | v22.22,94.46 v42.54,94.46 | v59.05,89.38 v61.59,89.38 | v74.29,91.92 75.56,93.19 80.64,93.19 83.18,90.65 89.53,90.65 90.8,91.92 IC2.1 v98.42,91.92 | v145.41,89.38 136.52,98.27 99.69,98.27 v98.42,97
MA0  (via drill 0.61)
  Top 0.254: P2.4 125.09,80.49 125.09,83.03 121.28,86.84 121.28,97 112.39,97 111.12,95.73 111.12,90.65 112.39,89.38 IC3.15 | v83.18,33.5 83.18,15.72 84.45,14.45 IC18.4
  Bottom 0.254: P2.4 P3.4 P4.4 P5.4 156.84,79.22 156.84,37.31 154.3,34.77 84.45,34.77 v83.18,33.5
MA1  (via drill 0.61)
  Top 0.254: v89.53,6.83 90.8,5.56 v90.8,3.02 | v127.63,8.1 130.17,10.64 130.17,72.87 P2.5 | v111.12,77.95 111.12,88.11 107.31,91.92 IC3.1
  Bottom 0.254: v90.8,3.02 92.07,1.75 121.28,1.75 v127.63,8.1 | IC18.7 v89.53,6.83 | v111.12,77.95 123.82,77.95 125.09,76.68 P2.5 P3.5 P4.5 P5.5
MA2  (via drill 0.61)
  Top 0.254: v108.58,74.14 108.58,88.11 107.31,89.38 IC3.2 | v142.87,9.37 150.49,16.99 150.49,69.06 P5.7
  Bottom 0.254: v108.58,74.14 111.12,71.6 P2.7 P3.7 P4.7 P5.7 | v142.87,9.37 127.63,9.37 121.28,3.02 95.88,3.02 94.61,4.29 IC18.9
MA3  (via drill 0.61)
  Top 0.254: v137.79,69.06 v137.79,88.11 | v145.41,10.64 151.76,16.99 151.76,67.79 P5.8
  Bottom 0.254: v137.79,88.11 108.58,88.11 107.31,86.84 IC3.3 | P2.8 P3.8 v137.79,69.06 P4.8 P5.8 | v145.41,10.64 95.88,10.64 94.61,11.91 IC18.12
MA4  (via drill 0.61)
  Top 0.254: IC17.4 85.72,48.74 87.62,51.28 87.62,57 v89.53,58.9 89.53,63.98 90.8,65.25 v90.8,83.03
  Bottom 0.254: v89.53,58.9 99.69,58.9 100.96,60.17 125.09,60.17 P2.11 P3.11 P4.11 P5.11 | v90.8,83.03 103.5,83.03 104.77,84.3 IC3.4
MA5  (via drill 0.61)
  Top 0.254: v99.69,41.12 100.96,42.39 106.04,42.39 v106.04,41.12 | v136.52,39.85 142.87,46.2 142.87,57.63 P4.12
  Bottom 0.254: IC3.5 109.85,81.76 111.12,80.49 122.55,80.49 125.09,77.95 154.3,77.95 155.57,76.68 155.57,58.9 P5.12 P4.12 P3.12 P2.12 | v99.69,41.12 98.42,41.12 97.15,39.85 86.99,39.85 85.72,41.12 IC17.7 | v106.04,41.12 107.31,39.85 v136.52,39.85
MA6  (via drill 0.61)
  Top 0.254: v94.61,33.5 94.61,37.31 93.34,38.58 IC17.9 | v127.63,32.23 127.63,52.55 P2.14 125.09,55.09 125.09,72.87 v122.55,75.41
  Bottom 0.254: v94.61,33.5 95.88,32.23 v127.63,32.23 | v122.55,75.41 111.12,75.41 107.31,79.22 IC3.6 | P2.14 P3.14 P4.14 P5.14
MA7  (via drill 0.61)
  Top 0.254: v122.55,72.87 123.82,71.6 123.82,53.82 P2.15
  Bottom 0.254: v122.55,72.87 111.12,72.87 107.31,76.68 IC3.7 | P2.15 P3.15 P4.15 P5.15 154.3,51.28 154.3,47.47 125.09,47.47 120.01,42.39 97.15,42.39 93.34,46.2 IC17.12
MA8  (via drill 0.61)
  Top 0.254: 122.55,50.01 122.55,63.98 121.28,65.25 v121.28,85.57 | 122.55,50.01 P2.17 | v118.74,19.53 121.28,22.07 121.28,39.85 122.55,41.12 122.55,50.01
  Bottom 0.254: v121.28,85.57 76.83,85.57 73.02,81.76 IC5.12 | IC14.15 v118.74,19.53 | P2.17 P3.17 P4.17 P5.17
MA9  (via drill 0.61)
  Top 0.254: v73.02,71.6 73.02,74.14 IC5.9 | v97.15,71.6 97.15,37.31 102.23,32.23 102.23,23.34 IC14.1 | P2.18 122.55,39.85 v122.55,24.61
  Bottom 0.254: P2.18 P3.18 P4.18 P5.18 | v97.15,71.6 v73.02,71.6 | v122.55,24.61 118.74,20.8 106.04,20.8 104.77,22.07 IC14.1
MA10  (via drill 0.61)
  Top 0.254: v90.8,84.3 90.8,89.38 89.53,90.65 v89.53,94.46 | v122.55,94.46 132.71,84.3 132.71,43.66 133.98,42.39 | 133.98,42.39 P3.19 | v131.44,24.61 133.98,27.15 133.98,42.39
  Bottom 0.254: v90.8,84.3 89.53,83.03 84.45,83.03 81.91,80.49 76.83,80.49 74.29,77.95 67.94,77.95 66.67,76.68 IC5.7 | v122.55,94.46 v89.53,94.46 | v131.44,24.61 125.09,24.61 118.74,18.26 106.04,18.26 104.77,19.53 IC14.2 | P2.19 P3.19 P4.19 P5.19
MD0  (via drill 0.61)
  Top 0.254: v100.96,65.25 100.96,57.63 102.23,56.36 IC10.2 | v131.44,65.25 131.44,76.68 P2.3
  Bottom 0.254: v100.96,65.25 104.77,65.25 105.41,65.89 106.67,65.89 107.31,65.25 v131.44,65.25 | P2.3 P3.3 P4.3 P5.3
MD1  (via drill 0.61)
  Top 0.254: v99.69,70.33 98.42,69.06 98.42,43.66 99.69,43.66 100.96,44.93 100.96,52.55 102.23,53.82 IC10.3
  Bottom 0.254: P2.6 P3.6 P4.6 P5.6 154.3,74.14 154.3,70.33 v99.69,70.33
MD2  (via drill 0.61)
  Top 0.254: v107.31,51.28 108.58,52.55 108.58,55.09 113.66,55.09 v113.66,61.44
  Bottom 0.254: v113.66,61.44 114.93,62.71 125.09,62.71 P2.10 P3.10 P4.10 P5.10 | IC10.4 v107.31,51.28
MD3  (via drill 0.61)
  Top 0.254: v106.67,55.09 106.04,54.46 106.04,50.01 104.77,48.74 IC10.5
  Bottom 0.254: v106.67,55.09 125.09,55.09 P2.13 P3.13 P4.13 P5.13
MD4
  Bottom 0.254: IC10.6 107.31,46.2 108.58,44.93 112.39,44.93 113.66,46.2 122.55,46.2 125.09,48.74 P2.16 P3.16 P4.16 P5.16
MD5  (via drill 0.7)
  Top 0.254: P3.20 P4.20 | v116.2,33.5 v116.2,38.58 | v102.86,33.5 98.42,37.95 98.42,41.12 100.96,43.66 IC10.7
  Bottom 0.254: P4.20 P5.20 | P3.20 P2.20 v116.2,38.58 | v102.86,33.5 v116.2,33.5
MD6  (via drill 0.61)
  Top 0.254: P3.23 P4.23 | v106.04,29.69 106.04,39.85 104.77,41.12 IC10.8
  Bottom 0.254: P4.23 P5.23 | v106.04,29.69 125.09,29.69 P2.23 P3.23
MD7  (via drill 0.61)
  Top 0.254: P3.25 P4.25 | v123.82,37.31 125.09,36.04 125.09,27.15 P2.25
  Bottom 0.254: P4.25 P5.25 | v123.82,37.31 106.04,37.31 104.77,38.58 IC10.9 | P2.25 P3.25
MPHI2  (via drill 0.61)  (1 unrouted)
  Top 0.254: v29.84,79.22 31.11,77.95 36.19,77.95 36.19,63.98 | 36.19,63.98 36.19,58.9 34.92,57.63 34.92,44.93 36.19,43.66 IC4.6 | IC3.13 IC3.14 | IC14.13 IC14.14 112.39,16.99 114.93,20.17 114.93,65.89 117.47,68.43 117.47,76.68 | 117.47,76.68 114.93,79.22 IC3.11 | 117.47,76.68 v117.47,84.3 | 36.19,63.98 v38.73,63.98 | v84.45,63.98 89.53,70.33 v89.53,79.22
  Bottom 0.254: v29.84,79.22 IC13.9 | 103.5,80.49 102.23,79.22 IC2.9 | 103.5,80.49 109.85,80.49 111.12,79.22 IC3.11 | v117.47,84.3 IC3.13 | v38.73,63.98 v84.45,63.98 | v89.53,79.22 90.8,80.49 103.5,80.49
MR/-W  (via drill 0.61)
  Top 0.254: v51.43,58.9 v51.43,66.52 | v102.23,69.06 102.23,58.9 IC10.1 | v29.84,84.3 31.11,85.57 31.11,90.65 37.46,90.65 v37.46,93.19 | v53.97,91.92 v52.7,93.19 | v60.32,90.65 60.32,88.11 61.59,86.84 61.59,74.14 62.86,72.87 v62.86,67.79
  Bottom 0.254: P2.21 P3.21 P4.21 P5.21 155.57,38.58 155.57,57.63 106.04,57.63 104.77,58.9 IC10.1 | v51.43,58.9 48.89,58.9 47.62,57.63 43.81,57.63 42.54,56.36 IC4.1 | v51.43,66.52 52.7,67.79 v62.86,67.79 78.1,67.79 79.37,69.06 v102.23,69.06 | v52.7,93.19 v37.46,93.19 | v53.97,91.92 53.97,90.65 v60.32,90.65 | v29.84,84.3 IC13.11
N$1
  Bottom 0.254: IC20.12 IC19.5
N$2  (1 unrouted)
N$3  (via drill 0.61)
  Top 0.254: v47.62,55.09 47.62,65.25 v46.35,66.52 | v98.42,70.33 v98.42,86.84
  Bottom 0.254: v47.62,55.09 36.19,55.09 34.92,56.36 IC11.19 | v46.35,66.52 50.16,66.52 53.97,70.33 69.21,70.33 70.48,69.06 75.56,69.06 76.83,70.33 v98.42,70.33 | v98.42,86.84 97.15,88.11 90.8,88.11 89.53,89.38 IC12.15
N$4  (via drill 0.61)
  Top 0.254: v33.65,53.82 33.65,63.98 32.38,65.25 31.11,63.98 28.57,66.52 v28.57,97 | v67.94,97 69.21,98.27 75.56,98.27 v75.56,88.11 | v89.53,88.11 89.53,83.03 88.26,81.76 IC12.12
  Bottom 0.254: v33.65,53.82 31.11,53.82 31.11,50.01 26.03,50.01 26.03,47.47 34.92,47.47 36.19,46.2 IC4.5 | v28.57,97 29.84,98.27 66.67,98.27 v67.94,97 | v75.56,88.11 v89.53,88.11
N$5  (via drill 0.61)
  Top 0.254: v24.76,29.69 v24.76,55.09
  Bottom 0.254: v24.76,55.09 23.49,55.09 22.22,53.82 IC11.3 | v24.76,29.69 26.03,28.42 JP2.2
N$6  (1 unrouted)
N$7  (1 unrouted)
N$11
  Top 0.254: IC2.3 IC2.2
N$12
  Top 0.254: IC2.5 IC2.4
RWDATA
  Top 0.254: IC6.5 IC6.4 IC6.3
  Bottom 0.254: IC6.5 IC6.10
VCC  (via drill 0.61)
  Top 0.254: C19.+ 10.79,4.29 | 27.3,38.58 IC11.12 | C16.+ 118.74,86.84 | 118.74,63.98 C15.+ | C18.+ 118.74,13.18 | 118.74,30.96 C17.+
  Top 0.406: C20.1 IC18.16 | IC14.16 C24.1 | C14.1 IC19.16 78.1,22.07 79.37,20.8 79.37,18.26 73.66,18.26 69.84,14.45 IC19.4 | C12.1 IC20.16 | IC1.20 C6.1 | 22.22,48.74 23.49,50.01 v23.49,53.82 23.49,56.36 26.03,56.36 IC11.20 C2.1 | 10.79,4.29 9.52,5.56 9.52,11.91 P1.C2 P1.C3 | IC6.14 C3.1 26.03,37.31 27.3,38.58 | v31.11,19.53 31.11,25.88 JP2.3 | 22.22,48.74 23.49,47.47 v23.49,41.12 | 22.22,48.74 IC11.5 | IC12.16 C10.1 89.53,95.73 v89.53,97 | IC5.16 C8.1 | IC13.14 C1.1 | C4.1 IC9.20 | C22.1 IC2.14 | C23.1 IC3.16 120.01,91.92 120.01,88.11 118.74,86.84 | C22.1 107.31,95.73 107.31,94.46 v109.85,91.92 | C11.1 IC15.20 | IC4.16 C5.1 | C9.1 IC16.20 | C13.1 IC17.16 | C21.1 IC10.20 | P5.1 155.57,84.3 155.57,15.72 P5.30 | v94.61,97 95.24,97 96.52,98.27 100.96,98.27 C22.1 | C7.1 IC8.20
  Top 0.61: P2.30 118.74,13.18 120.64,14.45 120.64,16.36 119.38,16.99 117.47,18.9 117.47,25.88 118.74,27.15 118.74,30.96 120.01,32.23 120.01,40.49 120.64,41.12 120.64,44.93 | P3.30 P4.30 | 120.64,44.93 120.64,52.55 | 120.64,52.55 120.64,62.08 118.74,63.98 120.01,65.25 120.01,85.57 118.74,86.84 | 120.64,52.55 JP1.4 | 120.64,44.93 JP1.1
  Bottom 0.254: 36.19,27.15 IC1.1 | 118.74,86.84 C16.+ | C15.+ 118.74,63.98 | 118.74,13.18 C18.+
  Bottom 0.406: IC14.16 110.48,22.07 107.94,24.61 94.61,24.61 C20.1 90.16,25.88 88.89,24.61 75.56,24.61 | IC20.4 55.24,14.45 56.51,13.18 62.23,13.18 63.5,14.45 IC19.4 | 57.78,24.61 C12.1 | 57.78,24.61 49.53,24.61 46.98,27.15 IC1.20 IC1.1 | 75.56,24.61 C14.1 | 57.78,24.61 75.56,24.61 | v23.49,53.82 IC11.18 | IC6.14 JP2.3 34.92,25.88 36.19,27.15 | P1.C3 14.6,19.53 v31.11,19.53 | v23.49,41.12 26.03,38.58 IC11.12 | 67.94,94.46 57.78,94.46 C7.1 55.24,94.46 44.45,94.46 43.18,95.73 C4.1 | 67.94,94.46 70.48,91.92 IC5.16 | C10.1 85.72,94.46 67.94,94.46 | IC9.20 IC9.1 IC13.14 | IC3.16 v109.85,91.92 | IC16.20 IC16.1 IC4.16 | C9.1 66.03,60.17 67.3,58.9 71.75,58.9 73.02,60.17 C11.1 84.45,60.17 85.72,58.9 87.62,58.9 88.89,60.17 C13.1 93.34,61.44 109.85,61.44 C21.1 112.39,63.98 118.74,63.98 | v94.61,97 v89.53,97 | 118.74,13.18 116.2,15.72 100.96,15.72 94.61,22.07 IC18.16
  Bottom 0.61: 118.74,86.84 P2.1 P3.1 P4.1 P5.1 | P4.30 P5.30 | P2.30 P3.30

### Text on the board
Top: CSA_RAMDISK-V1.0B | (C) A. Fachat